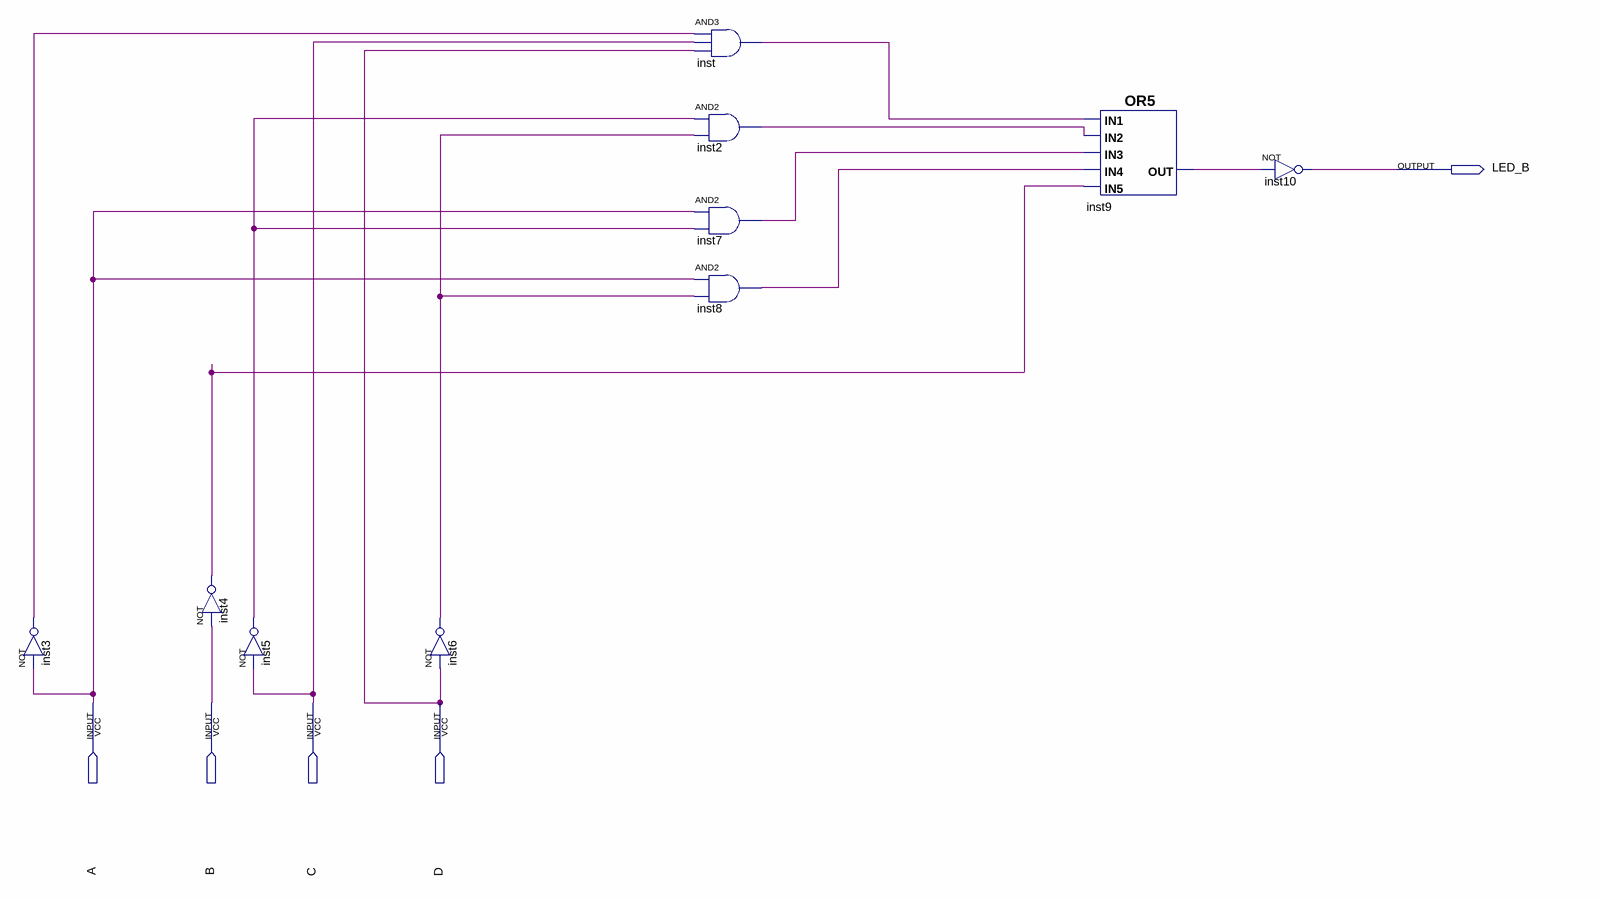
[diagram p0: schematic sheet]
// Quartus schematic led_b.bdf as structural Verilog: 10 symbols, 5 pins
module led_b (
  input  A,
  input  B,
  input  C,
  input  D,
  output LED_B
);

  wire inst2_out, inst3_out, inst4_out, inst5_out, inst6_out, inst7_out, inst8_out, inst9_out, inst_out;

  not inst3 (inst3_out, A);
  not inst4 (inst4_out, B);
  not inst5 (inst5_out, C);
  not inst6 (inst6_out, D);
  and inst (inst_out, inst3_out, C, D);
  and inst2 (inst2_out, inst5_out, inst6_out);
  and inst7 (inst7_out, A, inst5_out);
  and inst8 (inst8_out, A, inst6_out);
  or inst9 (inst9_out, inst_out, inst2_out, inst7_out, inst8_out, inst4_out);
  not inst10 (LED_B, inst9_out);
endmodule
